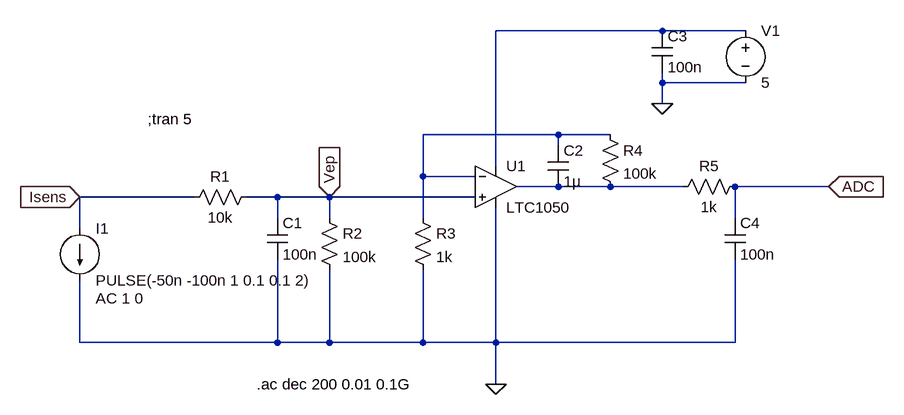
[diagram p0: schematic tension_adaptation_circuit.asc]
tension_adaptation_circuit.asc, the LTspice schematic file:
Version 4
SHEET 1 1372 680
WIRE 1008 -144 752 -144
WIRE 1136 -144 1008 -144
WIRE 1008 -64 1008 -80
WIRE 1136 -64 1008 -64
WIRE 1008 -32 1008 -64
WIRE 848 16 640 16
WIRE 928 16 848 16
WIRE 848 32 848 16
WIRE 752 64 752 -144
WIRE 640 80 640 16
WIRE 720 80 640 80
WIRE 848 96 784 96
WIRE 928 96 848 96
WIRE 1040 96 928 96
WIRE 1264 96 1120 96
WIRE 288 112 112 112
WIRE 416 112 368 112
WIRE 496 112 416 112
WIRE 720 112 496 112
WIRE 416 144 416 112
WIRE 496 144 496 112
WIRE 640 144 640 80
WIRE 1120 144 1120 96
WIRE 112 160 112 112
WIRE 112 336 112 240
WIRE 416 336 416 208
WIRE 416 336 112 336
WIRE 496 336 496 224
WIRE 496 336 416 336
WIRE 640 336 640 224
WIRE 640 336 496 336
WIRE 752 336 752 128
WIRE 752 336 640 336
WIRE 1120 336 1120 208
WIRE 1120 336 752 336
WIRE 752 400 752 336
FLAG 1008 -32 0
FLAG 752 400 0
FLAG 496 112 Vep
IOPIN 496 112 In
FLAG 1264 96 ADC
IOPIN 1264 96 In
FLAG 112 112 Isens
IOPIN 112 112 In
SYMBOL current 112 160 R0
WINDOW 123 24 108 Left 2
WINDOW 39 0 0 Left 0
SYMATTR Value2 AC 1 0
SYMATTR InstName I1
SYMATTR Value PULSE(-50n -100n 1 0.1 0.1 2)
SYMBOL res 384 96 R90
WINDOW 0 0 56 VBottom 2
WINDOW 3 32 56 VTop 2
SYMATTR InstName R1
SYMATTR Value 10k
SYMBOL res 480 128 R0
SYMATTR InstName R2
SYMATTR Value 100k
SYMBOL res 624 128 R0
SYMATTR InstName R3
SYMATTR Value 1k
SYMBOL res 912 0 R0
SYMATTR InstName R4
SYMATTR Value 100k
SYMBOL res 1136 80 R90
WINDOW 0 0 56 VBottom 2
WINDOW 3 32 56 VTop 2
SYMATTR InstName R5
SYMATTR Value 1k
SYMBOL cap 400 144 R0
SYMATTR InstName C1
SYMATTR Value 100n
SYMBOL cap 832 32 R0
SYMATTR InstName C2
SYMATTR Value 1µ
SYMBOL cap 992 -144 R0
SYMATTR InstName C3
SYMATTR Value 100n
SYMBOL cap 1104 144 R0
SYMATTR InstName C4
SYMATTR Value 100n
SYMBOL Opamps\\LTC1050 752 32 R0
SYMATTR InstName U1
SYMBOL voltage 1136 -160 R0
WINDOW 123 0 0 Left 0
WINDOW 39 0 0 Left 0
SYMATTR InstName V1
SYMATTR Value 5
TEXT 384 400 Left 2 !.ac dec 200 0.01 0.1G
TEXT 216 -8 Left 2 !;tran 5

The netlist it stands for:
* tension_adaptation_circuit.asc
I1 Isens 0 PULSE(-50n -100n 1 0.1 0.1 2) AC 1 0
R1 Vep Isens 10k
R2 Vep 0 100k
R3 N002 0 1k
R4 N002 N003 100k
R5 ADC N003 1k
C1 Vep 0 100n
C2 N002 N003 1µ
C3 N001 0 100n
C4 ADC 0 100n
XU1 Vep N002 N001 0 N003 LTC1050  ; pins In+ In- V+ V- OUT
V1 N001 0 5
.ac dec 200 0.01 0.1G
;tran 5
.lib LTC.lib
.backanno
.end